# Altium schematic sheet nir_usb_top.SchDoc
size A4
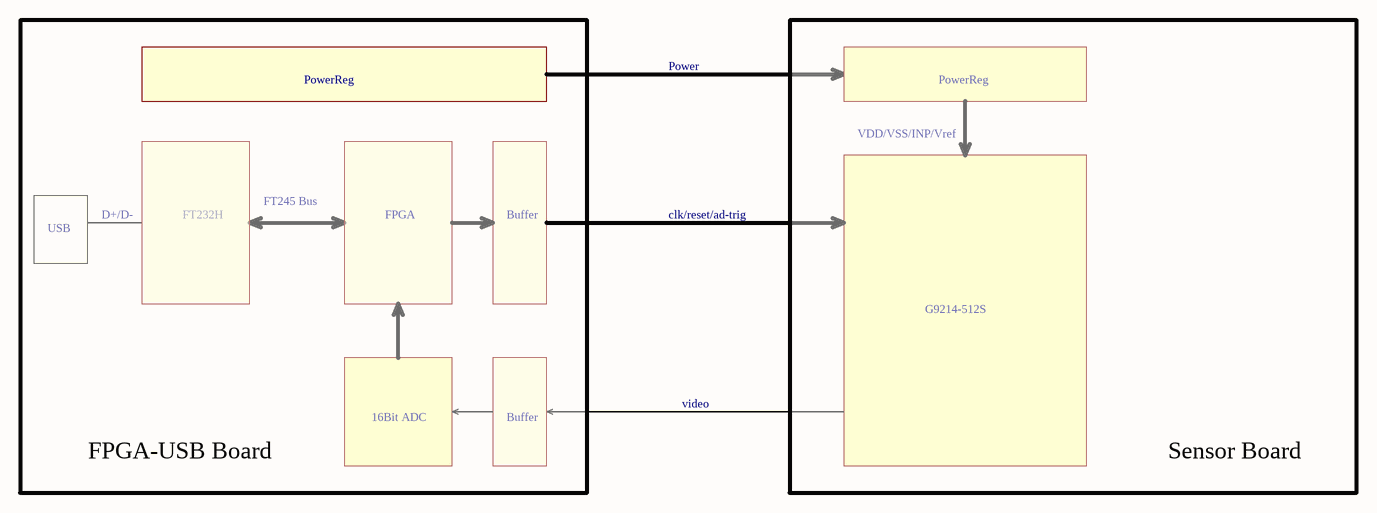
[diagram p0: nir_usb_top.SchDoc]

## Notes on the sheet
- Power
- PowerReg
- VDD/VSS/INP/Vref
- FT245 Bus
- USB
- D+/D-
- FT232H
- FPGA
- Buffer
- clk/reset/ad-trig
- G9214-512S
- video
- FPGA-USB Board
- 16Bit ADC
- Sensor Board